# Altium project DM3370.PrjPcb (part 7 of 14)

## Sheet DM3370_PCIe.SchDoc: =project_title
size Tabloid; CompanyName: Luxonis Holding; DrawnBy: David Malovrh; Organization: Luxonis Holding; Address1: 1925 Harmony Park Drive; Address2: Westminster, CO; Address3: 80234; Address4: United States; DocumentNumber: 12; Revision: R5M2E5; SheetNumber: 12; SheetTotal: 17
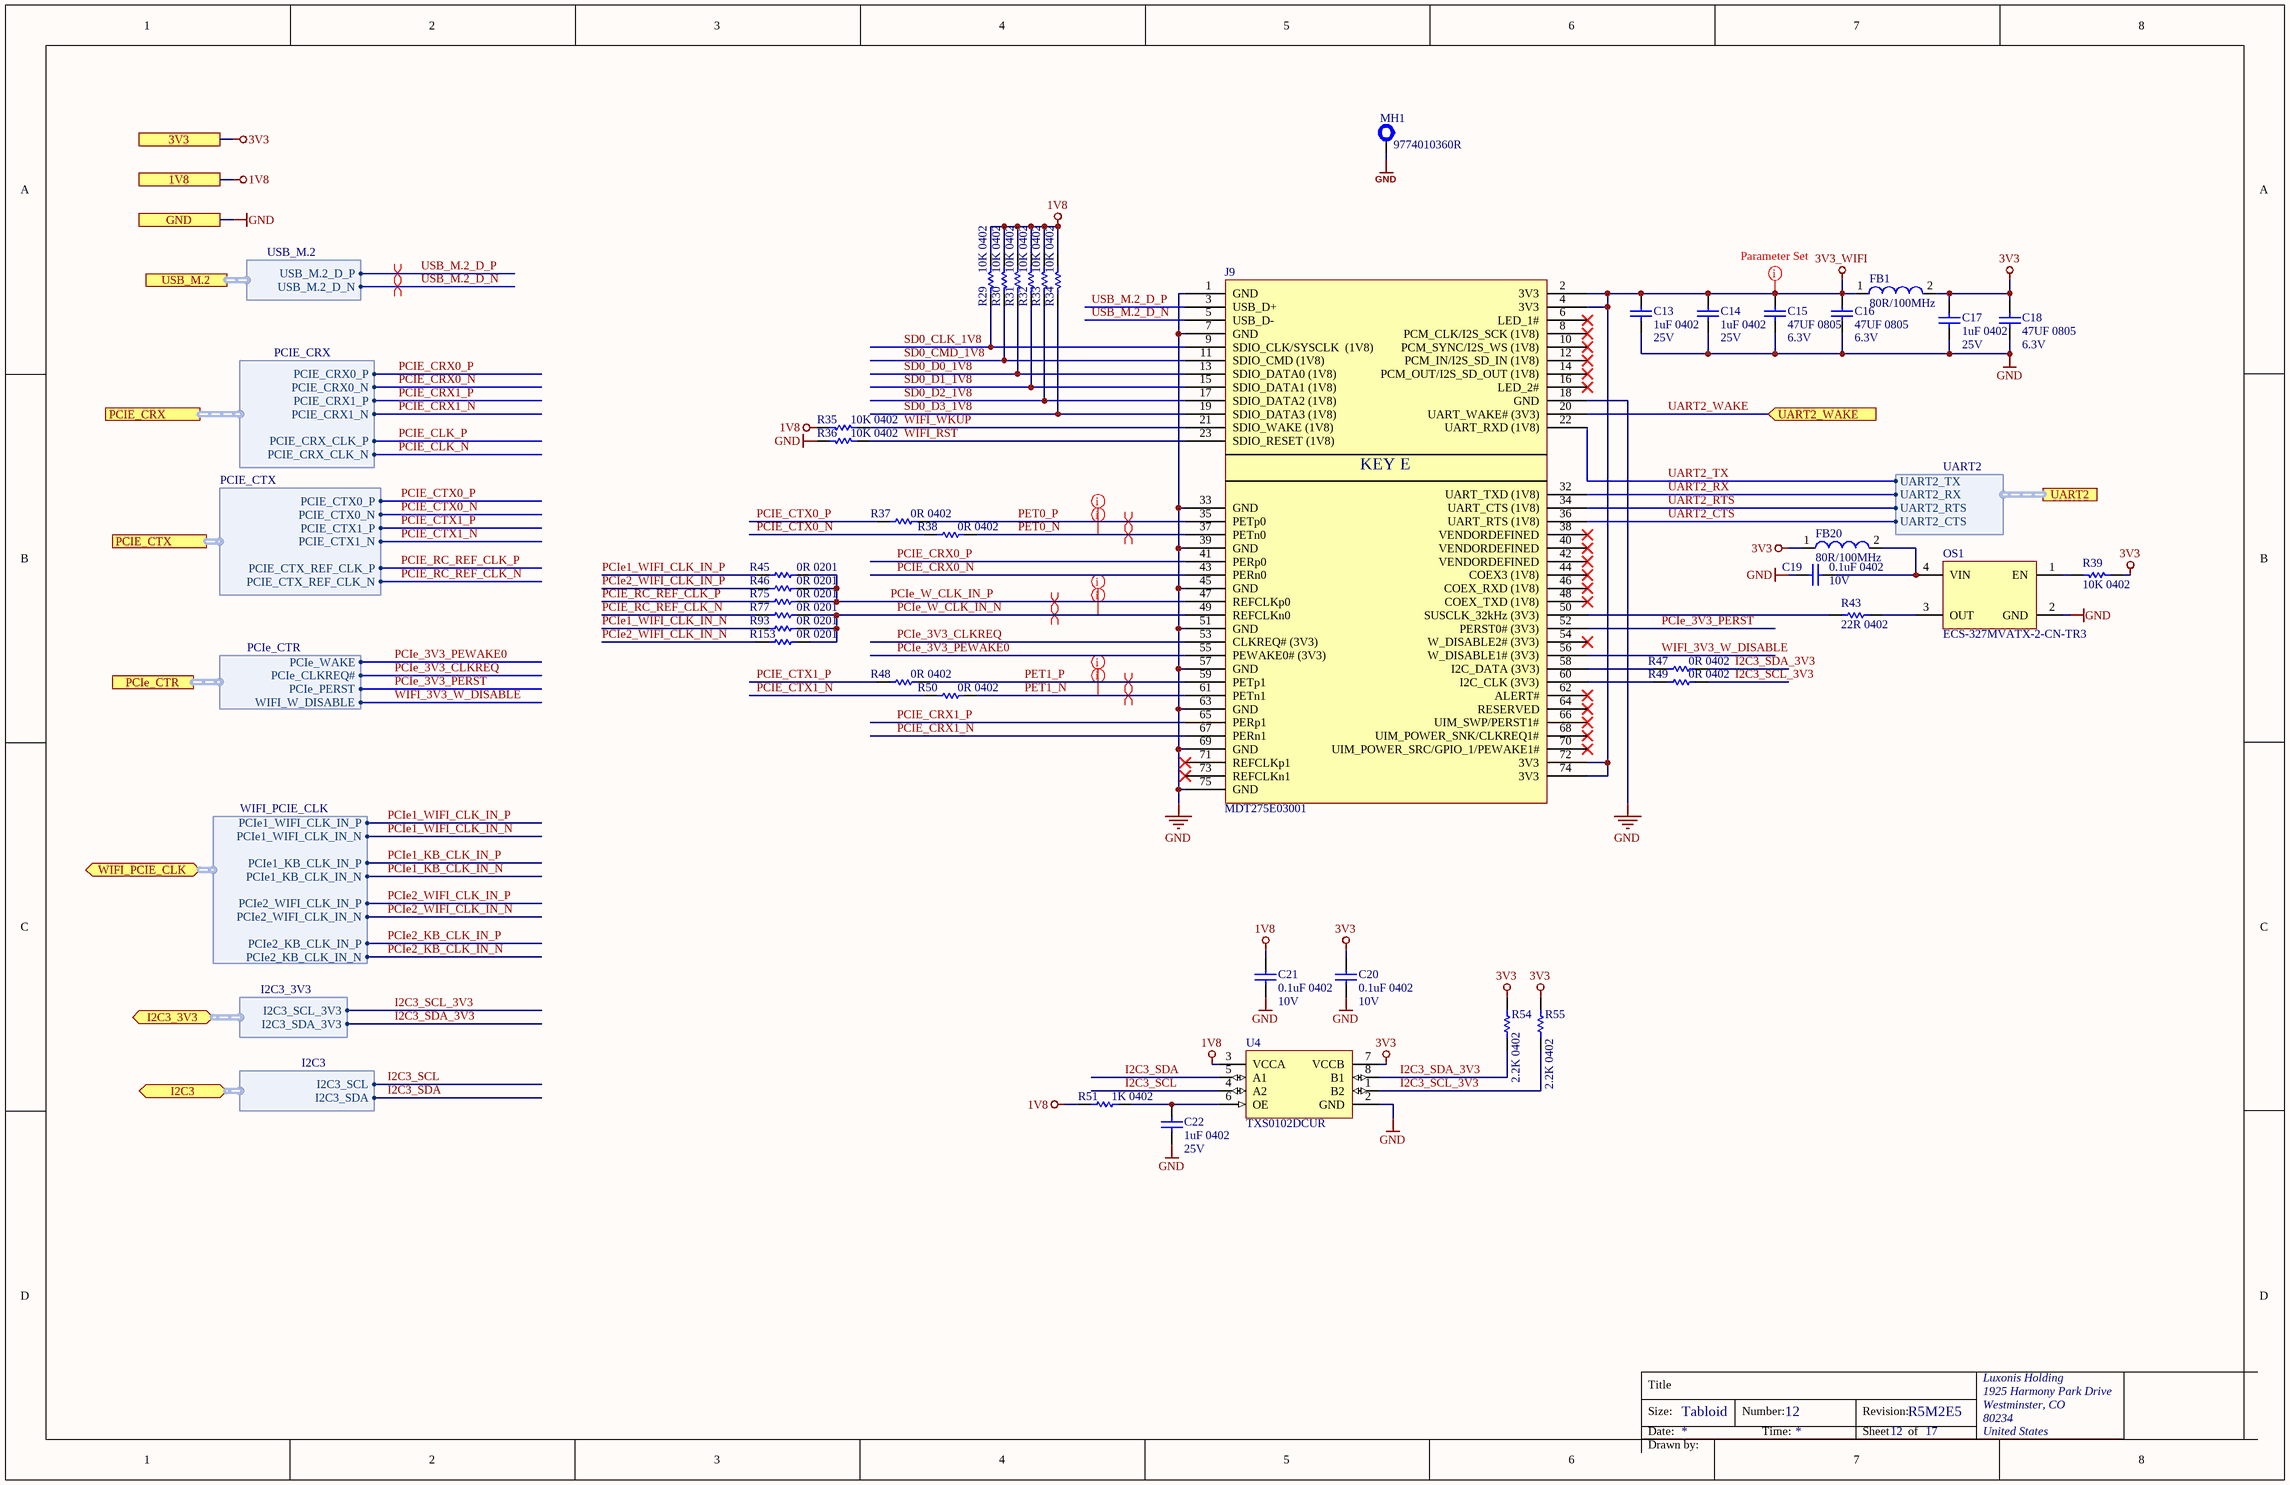
[diagram p11: DM3370_PCIe.SchDoc]

### Parts
C13  1uF 0402  Voltage Rating: 25V  [CAPC0402(1005)70_L]
C14  1uF 0402  Voltage Rating: 25V  [CAPC0402(1005)70_L]
C15  47UF 0805  Voltage: 6.3V  [CAPC0805(2012)145_L]
C16  47UF 0805  Voltage: 6.3V  [CAPC0805(2012)145_L]
C17  1uF 0402  Voltage Rating: 25V  [CAPC0402(1005)70_L]
C18  47UF 0805  Voltage: 6.3V  [CAPC0805(2012)145_L]
C19  0.1uF 0402  Voltage Rating: 10V  [CAPC0402(1005)70_L]
C20  0.1uF 0402  Voltage Rating: 10V  [CAPC0402(1005)70_L]
C21  0.1uF 0402  Voltage Rating: 10V  [CAPC0402(1005)70_L]
C22  1uF 0402  Voltage Rating: 25V  [CAPC0402(1005)70_L]
FB1  80R/100MHz  [BK1608HS800-T_L]
FB20  80R/100MHz  [BK1608HS800-T_L]
J9  MDT275E03001  [MDT275E]
MH1  9774010360R  [9774010360R]
OS1  ECS-327MVATX-2-CN-TR3  [2520_OSC(FJ2400002)]
R29  10K 0402  [RESC0402(1005)_L]
R30  10K 0402  [RESC0402(1005)_L]
R31  10K 0402  [RESC0402(1005)_L]
R32  10K 0402  [RESC0402(1005)_L]
R33  10K 0402  [RESC0402(1005)_L]
R34  10K 0402  [RESC0402(1005)_L]
R35  10K 0402  [RESC0402(1005)_L]
R36  10K 0402  [RESC0402(1005)_L]
R37  0R 0402  [RESC0402(1005)_L]
R38  0R 0402  [RESC0402(1005)_L]
R39  10K 0402  [RESC0402(1005)_L]
R43  22R 0402  [RESC0402(1005)_L]
R45  0R 0201  [RESC0201(0603)_L]
R46  0R 0201  [RESC0201(0603)_L]
R47  0R 0402  [RESC0402(1005)_L]
R48  0R 0402  [RESC0402(1005)_L]
R49  0R 0402  [RESC0402(1005)_L]
R50  0R 0402  [RESC0402(1005)_L]
R51  1K 0402  [RESC0402(1005)_L]
R54  2.2K 0402  [RESC0402(1005)_L]
R55  2.2K 0402  [RESC0402(1005)_L]
R75  0R 0201  [RESC0201(0603)_L]
R77  0R 0201  [RESC0201(0603)_L]
R93  0R 0201  [RESC0201(0603)_L]
R153  0R 0201  [RESC0201(0603)_L]
U4  TXS0102DCUR  [TXS0102DCUR]

### Ports
1V8, 3V3, GND, I2C3 (bidir, harness I2C3), I2C3_3V3 (bidir, harness I2C3_3V3), PCIE_CRX (harness PCIE_CRX), PCIe_CTR (harness PCIe_CTR), PCIE_CTX (harness PCIE_CTX), UART2 (harness UART2), UART2_WAKE (in), USB_M.2 (harness USB_M.2), WIFI_PCIE_CLK (bidir, harness WIFI_PCIE_CLK)

### Harnesses
PCIE_CRX: PCIE_CRX0_P, PCIE_CRX0_N, PCIE_CRX1_P, PCIE_CRX1_N, PCIE_CRX_CLK_P, PCIE_CRX_CLK_N
PCIE_CTX: PCIE_CTX0_P, PCIE_CTX0_N, PCIE_CTX1_P, PCIE_CTX1_N, PCIE_CTX_REF_CLK_P, PCIE_CTX_REF_CLK_N
PCIe_CTR: PCIe_CLKREQ#, PCIe_PERST, PCIe_WAKE, WIFI_W_DISABLE
UART2: UART2_TX, UART2_RX, UART2_CTS, UART2_RTS
WIFI_PCIE_CLK: PCIe1_WIFI_CLK_IN_P, PCIe1_WIFI_CLK_IN_N, PCIe1_KB_CLK_IN_P, PCIe1_KB_CLK_IN_N, PCIe2_WIFI_CLK_IN_P, PCIe2_WIFI_CLK_IN_N, PCIe2_KB_CLK_IN_P, PCIe2_KB_CLK_IN_N
I2C3_3V3: I2C3_SCL_3V3, I2C3_SDA_3V3
I2C3: I2C3_SCL, I2C3_SDA
USB_M.2: USB_M.2_D_P, USB_M.2_D_N

### Nets
1V8: C21.2 R29.1 R30.1 R31.1 R32.1 R33.1 R34.1 R35.2 R51.2 U4.3(VCCA) ; port 1V8
3V3: C17.2 C18.2 C20.2 FB1.2 FB20.1 R39.2 R54.2 R55.2 U4.7(VCCB) ; port 3V3
3V3_WIFI: C13.2 C14.2 C15.2 C16.2 FB1.1 J9.2(3V3) J9.4(3V3) J9.72(3V3) J9.74(3V3)
GND: C13.1 C14.1 C15.1 C16.1 C17.1 C18.1 C19.1 C20.1 C21.1 C22.1 J9.1(GND) J9.7(GND) J9.18(GND) J9.33(GND) J9.39(GND) J9.45(GND) J9.51(GND) J9.57(GND) J9.63(GND) J9.69(GND) J9.75(GND) MH1.1 OS1.2(GND) R36.2 U4.2(GND) ; port GND
I2C3_SCL: U4.4(A2) ; port I2C3.I2C3_SCL
I2C3_SCL_3V3: R49.2 R55.1 U4.1(B2) ; port I2C3_3V3.I2C3_SCL_3V3
I2C3_SDA: U4.5(A1) ; port I2C3.I2C3_SDA
I2C3_SDA_3V3: R47.2 R54.1 U4.8(B1) ; port I2C3_3V3.I2C3_SDA_3V3
PCIe1_WIFI_CLK_IN_N: R93.1 ; port WIFI_PCIE_CLK.PCIe1_WIFI_CLK_IN_N
PCIe1_WIFI_CLK_IN_P: R45.1 ; port WIFI_PCIE_CLK.PCIe1_WIFI_CLK_IN_P
PCIe2_WIFI_CLK_IN_N: R153.1 ; port WIFI_PCIE_CLK.PCIe2_WIFI_CLK_IN_N
PCIe2_WIFI_CLK_IN_P: R46.1 ; port WIFI_PCIE_CLK.PCIe2_WIFI_CLK_IN_P
PCIe_3V3_CLKREQ: J9.53(CLKREQ#_(3V3)) ; port PCIe_CTR.PCIe_CLKREQ#
PCIe_3V3_PERST: J9.52(PERST0#_(3V3)) ; port PCIe_CTR.PCIe_PERST
PCIe_3V3_PEWAKE0: J9.55(PEWAKE0#_(3V3)) ; port PCIe_CTR.PCIe_WAKE
PCIE_CRX0_N: J9.43(PERn0) ; port PCIE_CRX.PCIE_CRX0_N
PCIE_CRX0_P: J9.41(PERp0) ; port PCIE_CRX.PCIE_CRX0_P
PCIE_CRX1_N: J9.67(PERn1) ; port PCIE_CRX.PCIE_CRX1_N
PCIE_CRX1_P: J9.65(PERp1) ; port PCIE_CRX.PCIE_CRX1_P
PCIE_CTX0_N: R38.1 ; port PCIE_CTX.PCIE_CTX0_N
PCIE_CTX0_P: R37.1 ; port PCIE_CTX.PCIE_CTX0_P
PCIE_CTX1_N: R50.1 ; port PCIE_CTX.PCIE_CTX1_N
PCIE_CTX1_P: R48.1 ; port PCIE_CTX.PCIE_CTX1_P
PCIE_RC_REF_CLK_N: R77.1 ; port PCIE_CTX.PCIE_CTX_REF_CLK_N
PCIE_RC_REF_CLK_P: R75.1 ; port PCIE_CTX.PCIE_CTX_REF_CLK_P
PCIe_W_CLK_IN_N: J9.49(REFCLKn0) R77.2 R93.2 R153.2
PCIe_W_CLK_IN_P: J9.47(REFCLKp0) R45.2 R46.2 R75.2
PET0_N: J9.37(PETn0) R38.2
PET0_P: J9.35(PETp0) R37.2
PET1_N: J9.61(PETn1) R50.2
PET1_P: J9.59(PETp1) R48.2
SD0_CLK_1V8: J9.9(SDIO_CLK/SYSCLK__(1V8)) R29.2
SD0_CMD_1V8: J9.11(SDIO_CMD_(1V8)) R30.2
SD0_D0_1V8: J9.13(SDIO_DATA0_(1V8)) R31.2
SD0_D1_1V8: J9.15(SDIO_DATA1_(1V8)) R32.2
SD0_D2_1V8: J9.17(SDIO_DATA2_(1V8)) R33.2
SD0_D3_1V8: J9.19(SDIO_DATA3_(1V8)) R34.2
UART2_CTS: J9.36(UART_RTS_(1V8)) ; port UART2.UART2_CTS
UART2_RTS: J9.34(UART_CTS_(1V8)) ; port UART2.UART2_RTS
UART2_RX: J9.32(UART_TXD_(1V8)) ; port UART2.UART2_RX
UART2_TX: J9.22(UART_RXD_(1V8)) ; port UART2.UART2_TX
UART2_WAKE: J9.20(UART_WAKE#_(3V3)) ; port UART2_WAKE
USB_M.2_D_N: J9.5(USB_D-) ; port USB_M.2.USB_M.2_D_N
USB_M.2_D_P: J9.3(USB_D+) ; port USB_M.2.USB_M.2_D_P
WIFI_3V3_W_DISABLE: J9.56(W_DISABLE1#_(3V3)) ; port PCIe_CTR.WIFI_W_DISABLE
WIFI_RST: J9.23(SDIO_RESET_(1V8)) R36.1
WIFI_WKUP: J9.21(SDIO_WAKE_(1V8)) R35.1
NetC19_2: C19.2 FB20.2 OS1.4(VIN)
NetC22_2: C22.2 R51.1 U4.6(OE)
NetJ9_50: J9.50(SUSCLK_32kHz_(3V3)) R43.2
NetJ9_58: J9.58(I2C_DATA_(3V3)) R47.1
NetJ9_60: J9.60(I2C_CLK_(3V3)) R49.1
NetOS1_1: OS1.1(EN) R39.1
NetOS1_3: OS1.3(OUT) R43.1

Not connected (* = marked no-connect by the designer): J9 6(LED_1#)* 8(PCM_CLK/I2S_SCK_(1V8))* 10(PCM_SYNC/I2S_WS_(1V8))* 12(PCM_IN/I2S_SD_IN_(1V8))* 14(PCM_OUT/I2S_SD_OUT_(1V8))* 16(LED_2#)* 38(VENDORDEFINED)* 40(VENDORDEFINED)* 42(VENDORDEFINED)* 44(COEX3_(1V8))* 46(COEX_RXD_(1V8))* 48(COEX_TXD_(1V8))* 54(W_DISABLE2#_(3V3))* 62(ALERT#)* 64(RESERVED)* 66(UIM_SWP/PERST1#)* 68(UIM_POWER_SNK/CLKREQ1#)* 70(UIM_POWER_SRC/GPIO_1/PEWAKE1#)* 71(REFCLKp1)* 73(REFCLKn1)*

### Layout directives
differential pair; differential pair class 100ohm; net class PCIE: PCIe_W_CLK_IN_N, PCIe_W_CLK_IN_P, PET0_N, PET0_P, PET1_N, PET1_P
net class POWER: 3V3_WIFI
net class PCIE: PCIe_W_CLK_IN_N, PCIe_W_CLK_IN_P, PET0_N, PET0_P, PET1_N, PET1_P
differential pair; differential pair class 90ohm: USB_M.2_D_N, USB_M.2_D_P

### Notes on the sheet
- Title
- Size:
- Date:
- Tabloid
- Number:
- Time:
- Revision:
- Sheet
- of
- Drawn by:
- (in symbol CMP-002-00122-1) KEY E

### Library data of the parts
C13 C14 C17 C22 = GRM155R61E105KA12D: as C160 on sheet DM3370_LCD_LEDring; Supplier 1: Digi-Key; Manufacturer Part Number 1: GRM155R61E105KA12D; Stock 1: 200653; Pricing 1: 1=0.10000, 10=0.07100, 100=0.03350, 500=0.02352, 1000=0.01947, 2500=0.01812, 5000=0.01658 (USD); RoHS: Yes; Mount: Surface Mount; Case/Package: 0402; Weight: 0.000212oz; Case Code (Metric): 1005; Case Code (Imperial): 0402; Min Operating Temperature: -55°C; Max Operating Temperature: 85°C; Tolerance: 10%; Capacitance: 1uF; Dielectric: X5R; Voltage Rating (DC): 25V; Packaging: Tape and Reel; Package Quantity: 10000; Termination: SMD/SMT; Voltage: 25V; Length: 1mm; Height: 0.5mm; Width: 0.5mm; Thickness: 0.022inch; Depth: 0.5mm; Lead Free: Lead Free; REACH SVHC: No SVHC; ComponentLink1URL: https://datasheet.ciiva.com/22732/1666664-22732122.pdf?src-supplier=Element14; ComponentLink1Description: https://datasheet.ciiva.com/22732/1666664-22732122.pdf?src-supplier=Element14; ComponentLink2URL: https://datasheet.ciiva.com/7719/1666664-7719006.pdf?src-supplier=Element14; ComponentLink2Description: https://datasheet.ciiva.com/7719/1666664-7719006.pdf?src-supplier=Element14; Supplier Part Number 1: 490-10017-1-ND; Supplier 2: Arrow; Supplier 3: TTI; Supplier Part Number 2: GRM155R61E105KA12D; Supplier Part Number 3: GRM155R61E105KA12D
C15 C16 C18 = GRM21BR60J476ME15L: CAP CER 47UF 6.3V X5R 0805; Manufacturer 1: Murata; Tolerance: 20%; Supplier 1: Digi-Key; Manufacturer Part Number 1: GRM21BR60J476ME15L; Stock 1: 16165; Pricing 1: 1=0.48000, 10=0.33900, 100=0.22360, 500=0.16560, 1000=0.14076 (USD); RoHS: Yes; Mount: Surface Mount; Case/Package: 0805; Weight: 0.000335oz; Case Code (Metric): 2012; Case Code (Imperial): 0805; Min Operating Temperature: -55°C; Max Operating Temperature: 85°C; Voltage Rating: 6.3V; Packaging: Tape and Reel; Capacitance: 47uF; Voltage Rating (DC): 6.3V; Package Quantity: 3000; Termination: SMD/SMT; Dielectric: X5R; Length: 2mm; Height: 1.25mm; Width: 0.049inch; Depth: 1.25mm; Thickness: 0.057inch; Lead Free: Lead Free; REACH SVHC: No SVHC; ComponentLink1URL: https://datasheet.ciiva.com/46444/1754700-46444997.pdf?src-supplier=Element14; ComponentLink1Description: https://datasheet.ciiva.com/46444/1754700-46444997.pdf?src-supplier=Element14; Supplier 2: Newark; Supplier 3: Mouser; Supplier Part Number 1: 490-9960-1-ND; Supplier Part Number 2: 40X5890; Supplier Part Number 3: 81-GRM21BR60J476ME5L
C19-C21 = GRM155R71A104JA01D: as C158 on sheet DM3370_LCD_LEDring; Supplier 1: Digi-Key; Manufacturer Part Number 1: GRM155R71A104JA01D; Stock 1: 1346709; Pricing 1: 1=0.10000, 10=0.02500, 100=0.01130, 500=0.00806, 1000=0.00633, 2500=0.00575, 5000=0.00529 (USD); RoHS: Yes; Mount: Surface Mount; Case/Package: 0402; Case Code (Imperial): 0402; Case Code (Metric): 1005; Min Operating Temperature: -55°C; Max Operating Temperature: 125°C; Tolerance: 5%; Packaging: Tape and Reel; Voltage Rating (DC): 10V; Dielectric: X7R; Package Quantity: 10000; Termination: SMD/SMT; Length: 1mm; Height: 0.5mm; Width: 0.02inch; Thickness: 0.022inch; Depth: 0.5mm; Radiation Hardening: No; Lead Free: Lead Free; ComponentLink1URL: https://datasheet.ciiva.com/5411/product-5411135.pdf?src-supplier=Mouser; ComponentLink1Description: https://datasheet.ciiva.com/5411/product-5411135.pdf?src-supplier=Mouser; ComponentLink2URL: https://datasheet.ciiva.com/11618/c02e-11618821.pdf?src-supplier=Avnet; ComponentLink2Description: https://datasheet.ciiva.com/11618/c02e-11618821.pdf?src-supplier=Avnet; Supplier Part Number 1: 490-10777-1-ND
FB1 FB20 = BK1608HS800-T: FERRITE BEAD 80 OHM 0603 1LN; Manufacturer 1: Taiyo Yuden; Impedance: 80R; Tolerance: 25%; Max DC Current: 600mA; DC Resistance (DCR): 100mR; Test Frequency: 100MHz; Number of Lines: 1; Shielding: Shielded; Supplier 1: Digi-Key; Manufacturer Part Number 1: BK1608HS800-T; Stock 1: 6285; Pricing 1: 1=0.10000, 10=0.07900, 25=0.07200, 50=0.06480, 100=0.04760, 250=0.03460, 500=0.03170, 1000=0.02738 (USD); RoHS: Yes; Mount: Surface Mount; Case/Package: 0603; Number of Pins: 2; Core Material: Ferrite; Case Code (Metric): 1608; Case Code (Imperial): 0603; Min Operating Temperature: -55°C; Max Operating Temperature: 125°C; Package Quantity: 1; Packaging: Tape and Reel; Termination: SMD/SMT; Max Current Rating: 600mA; Frequency: 100MHz; Length: 0.063inch; Height: 0.037inch; Width: 0.8mm; Depth: 0.95mm; REACH SVHC: Unknown; Lead Free: Lead Free; Halogen Free: Halogen Free; ComponentLink1URL: https://datasheet.ciiva.com/1011/bk1608hs800-t-ss-1011885.pdf?src-supplier=Digi-Key; ComponentLink1Description: https://datasheet.ciiva.com/1011/bk1608hs800-t-ss-1011885.pdf?src-supplier=Digi-Key; ComponentLink2URL: https://datasheet.ciiva.com/1011/mlci07-e-1011886.pdf?src-supplier=Digi-Key; ComponentLink2Description: https://datasheet.ciiva.com/1011/mlci07-e-1011886.pdf?src-supplier=Digi-Key; ComponentLink3URL: https://datasheet.ciiva.com/1011/mlci07-e-1011887.pdf?src-supplier=Digi-Key; ComponentLink3Description: https://datasheet.ciiva.com/1011/mlci07-e-1011887.pdf?src-supplier=Digi-Key; Supplier 2: Mouser; Supplier 3: Arrow; Supplier Part Number 1: 587-1875-1-ND; Supplier Part Number 2: 963-BK1608HS800-T; Supplier Part Number 3: BK1608HS800-T
J9 = CMP-002-00122-1: Conn Card Edge RCP 67 POS 0.5mm Solder RA SMD; Manufacturer 1: Amphenol Commercial; Stock 1: 1980; Manufacturer Part Number 1: MDT275E03001; Design Item ID: MDT420E03001; Category: Card Edge Connectors; RoHS: Yes
MH1 = CMP-00015-1: Spacers/Standoffs; Manufacturer 1: Wuerth; Manufacturer Part Number 1: 9774010360R
OS1 = CMP-016-000027-1: SMD Crystal Oscillator 32.768KHz 1.6V to 3.6V 15pF 4-Pin Miniature CSMD T/R; Manufacturer 1: ECS International; Pricing 1: 1=1,12000, 10=0,98900, 50=0,92440, 100=0,81700, 500=0,77400, 1000=0,64500 (USD); RoHS: No; Design Item ID: ECS-327MVATX-2-CN-TR3; Manufacturer Part Number 1: ECS-327MVATX-2-CN-TR3; Source: LuxonisMaster.SchLib; Stock 1: 3071
R29-R36 R39 = RC0402FR-1310KL: as R118 on sheet DM3370_LCD_LEDring; ComponentLink1URL: https://datasheet.ciiva.com/16940/pyu-rc0402-51-rohs-l-6-16940293.pdf?src-supplier=Avnet+Europe; ComponentLink1Description: https://datasheet.ciiva.com/16940/pyu-rc0402-51-rohs-l-6-16940293.pdf?src-supplier=Avnet+Europe; ComponentLink2URL: https://datasheet.ciiva.com/28386/pyu-rc0402-51-rohs-l-6-28386855.pdf?src-supplier=Avnet+Europe; ComponentLink2Description: https://datasheet.ciiva.com/28386/pyu-rc0402-51-rohs-l-6-28386855.pdf?src-supplier=Avnet+Europe; ComponentLink3URL: https://datasheet.ciiva.com/16740/pyu-rc0402-51-rohs-l-6-r-16740602.pdf?src-supplier=Future+Electronics; ComponentLink3Description: https://datasheet.ciiva.com/16740/pyu-rc0402-51-rohs-l-6-r-16740602.pdf?src-supplier=Future+Electronics; ComponentLink4URL: https://datasheet.ciiva.com/8891/pyu-rc0402-51-rohs-l-6-8891339.pdf?src-supplier=Avnet; ComponentLink4Description: https://datasheet.ciiva.com/8891/pyu-rc0402-51-rohs-l-6-8891339.pdf?src-supplier=Avnet; ComponentLink5URL: https://datasheet.ciiva.com/5557/pyu-rc0402-51-rohs-l-6-r-5557997.pdf?src-supplier=Mouser; ComponentLink5Description: https://datasheet.ciiva.com/5557/pyu-rc0402-51-rohs-l-6-r-5557997.pdf?src-supplier=Mouser; ComponentLink6URL: https://datasheet.ciiva.com/7983/1018594-7983533.pdf?src-supplier=Element14; ComponentLink6Description: https://datasheet.ciiva.com/7983/1018594-7983533.pdf?src-supplier=Element14; Supplier 1: Newark; Manufacturer Part Number 1: RC0402FR-1310KL; Stock 1: 62239; Pricing 1: 1=0.10000, 25=0.01200, 100=0.00400, 250=0.00400, 500=0.00300, 1000=0.00300 (USD); RoHS: Yes; Case/Package: 0402; Number of Pins: 2; Contact Plating: Tin,Matte,Lead; Case Code (Imperial): 0402; Case Code (Metric): 1005; Min Operating Temperature: -55°C; Max Operating Temperature: 155°C; Tolerance: 1%; Composition: Thick Film; Packaging: Tape and Reel; Termination: SMD/SMT; Military Standard: Not; Voltage Rating (DC): 50V; Working Voltage: 50V; Number of Terminations: 2; Length: 1mm; Depth: 0.5mm; Radiation Hardening: No; REACH SVHC: No SVHC; Lead Free: Lead Free; Supplier Part Number 1: 67R9960
  R29-R36: Supplier 2: Future Electronics; Supplier 3: Mouser; Supplier 4: Element14; Supplier Part Number 2: RC0402FR-1310KL-CUTT; Supplier Part Number 3: 603-RC0402FR-1310KL; Supplier Part Number 4: 1799235
R37 R38 R47-R50 = CRCW04020000Z0ED: as R158 on sheet DM3370_LCD_LEDring; Supplier 1: Digi-Key; Manufacturer Part Number 1: CRCW04020000Z0ED; Stock 1: 855968; Pricing 1: 1=0.10000, 10=0.03400, 25=0.02440, 50=0.01860, 100=0.01380, 250=0.01048, 500=0.00840, 1000=0.00618, 5000=0.00443 (USD); RoHS: Yes; Mount: Surface Mount; Case/Package: 0402; Weight: 2.3E-05oz; Case Code (Imperial): 0402; Case Code (Metric): 1005; Contact Plating: Tin; Min Operating Temperature: -55°C; Max Operating Temperature: 155°C; Packaging: Tape and Reel; Composition: Thick Film; Voltage Rating (DC): 50V; Package Quantity: 1; Termination: SMD/SMT; Number of Terminations: 2; Military Standard: Not; Max Power Dissipation: 63mW; Features: Automotive AEC-Q200; Length: 1mm; Height: 0.35mm; Width: 0.5mm; Depth: 0.5mm; Radiation Hardening: No; REACH SVHC: Unknown; Lead Free: Lead Free; ComponentLink1URL: https://datasheet.ciiva.com/3255/dcrcwe3-3255944.pdf?src-supplier=Avnet; ComponentLink1Description: https://datasheet.ciiva.com/3255/dcrcwe3-3255944.pdf?src-supplier=Avnet; ComponentLink2URL: https://datasheet.ciiva.com/3255/dcrcwe3-3255945.pdf?src-supplier=Avnet; ComponentLink2Description: https://datasheet.ciiva.com/3255/dcrcwe3-3255945.pdf?src-supplier=Avnet; ComponentLink3URL: https://datasheet.ciiva.com/16881/dcrcwe3-16881413.pdf?src-supplier=Avnet+Europe; ComponentLink3Description: https://datasheet.ciiva.com/16881/dcrcwe3-16881413.pdf?src-supplier=Avnet+Europe; ComponentLink4URL: https://datasheet.ciiva.com/2461/dcrcwe3-2461962.pdf?src-supplier=Digi-Key; ComponentLink4Description: https://datasheet.ciiva.com/2461/dcrcwe3-2461962.pdf?src-supplier=Digi-Key; ComponentLink5URL: https://datasheet.ciiva.com/7841/1720486-7841802.pdf?src-supplier=Element14; ComponentLink5Description: https://datasheet.ciiva.com/7841/1720486-7841802.pdf?src-supplier=Element14; ComponentLink6URL: https://datasheet.ciiva.com/2461/dcrcwe3-2461963.pdf?src-supplier=Digi-Key; ComponentLink6Description: https://datasheet.ciiva.com/2461/dcrcwe3-2461963.pdf?src-supplier=Digi-Key; ComponentLink7URL: https://datasheet.ciiva.com/2461/dcrcwe3-2461964.pdf?src-supplier=Digi-Key; ComponentLink7Description: https://datasheet.ciiva.com/2461/dcrcwe3-2461964.pdf?src-supplier=Digi-Key; ComponentLink8URL: https://datasheet.ciiva.com/7841/1697337-7841468.pdf?src-supplier=Element14; ComponentLink8Description: https://datasheet.ciiva.com/7841/1697337-7841468.pdf?src-supplier=Element14; ComponentLink9URL: https://datasheet.ciiva.com/16761/70200976-16761309.pdf?src-supplier=Allied+Electronics; ComponentLink9Description: https://datasheet.ciiva.com/16761/70200976-16761309.pdf?src-supplier=Allied+Electronics; ComponentLink10URL: https://datasheet.ciiva.com/26311/fld-crcw-e3-data-en-26311550.pdf?src-supplier=Distrelec; ComponentLink10Description: https://datasheet.ciiva.com/26311/fld-crcw-e3-data-en-26311550.pdf?src-supplier=Distrelec; Supplier Part Number 1: 541-0.0JCT-ND
R43 = RC0402FR-0722RL: RES SMD 22 OHM 1% 1/16W 0402; Manufacturer 1: Yageo; Temperature Coefficient: 100ppm/°C; Power Rating: 63mW; Voltage Rating: 50V; Supplier 1: Digi-Key; Manufacturer Part Number 1: RC0402FR-0722RL; Stock 1: 24616988; Pricing 1: 1=0.10000, 10=0.01600, 100=0.00640, 1000=0.00289, 2500=0.00251, 5000=0.00207 (USD); RoHS: Yes; Case/Package: 0402; Number of Pins: 2; Case Code (Metric): 1005; Case Code (Imperial): 0402; Min Operating Temperature: -55°C; Max Operating Temperature: 155°C; Tolerance: 1%; Resistance: 22R; Packaging: Tape and Reel; Composition: Thick Film; Voltage Rating (DC): 50V; Termination: SMD/SMT; Military Standard: Not; Length: 1mm; Height: 0.32mm; Width: 0.5mm; Depth: 0.5mm; REACH SVHC: Unknown; Lead Free: Lead Free; ComponentLink1URL: https://datasheet.ciiva.com/11819/0900766b80c66297-11819462.pdf?src-supplier=RSComponents; ComponentLink1Description: https://datasheet.ciiva.com/11819/0900766b80c66297-11819462.pdf?src-supplier=RSComponents; ComponentLink2URL: https://datasheet.ciiva.com/7849/1018594-7849911.pdf?src-supplier=Element14; ComponentLink2Description: https://datasheet.ciiva.com/7849/1018594-7849911.pdf?src-supplier=Element14; ComponentLink3URL: https://datasheet.ciiva.com/26829/getdatasheetpartid-554995-26829991.pdf?src-supplier=Verical; ComponentLink3Description: https://datasheet.ciiva.com/26829/getdatasheetpartid-554995-26829991.pdf?src-supplier=Verical; ComponentLink4URL: https://datasheet.ciiva.com/7849/1018594-7849912.pdf?src-supplier=Element14; ComponentLink4Description: https://datasheet.ciiva.com/7849/1018594-7849912.pdf?src-supplier=Element14; ComponentLink5URL: https://datasheet.ciiva.com/16930/pyu-rc0402-51-rohs-l-6-r-16930687.pdf?src-supplier=Future+Electronics; ComponentLink5Description: https://datasheet.ciiva.com/16930/pyu-rc0402-51-rohs-l-6-r-16930687.pdf?src-supplier=Future+Electronics; Supplier 2: Newark; Supplier 3: Mouser; Supplier Part Number 2: 26M6784; Supplier Part Number 3: 603-RC0402FR-0722RL; Supplier Part Number 1: 311-22.0LRCT-ND; Category: Chip SMD Resistors
R45 R46 R75 R77 R93 R153 = CRCW02010000Z0ED: RES SMD 0 OHM JUMPER 1/16W 0201; Manufacturer 1: Vishay; Rated Power Dissipation (P): 50mW; Rated Temperature: 70°C; Package Height: 0.23mm; Package Length: 0.6mm; Package Width: 0.3mm; Reference Standard: AEC-Q200; Supplier 1: Newark; Manufacturer Part Number 1: CRCW02010000Z0ED; RoHS: Yes; Category: Chip SMD Resistors; Stock 1: 200000; Pricing 1: 1=0,03600, 10000=0,03600, 30000=0,03400 (USD); Mount: Surface Mount; Number of Pins: 2; Package Shape: Rectangular; Size Code: 0201; Terminal Finish: Nickel; Min Operating Temperature: -55°C; Max Operating Temperature: 155°C; JESD-609 Code: e3; Resistor Type: FIXED RESISTOR; Construction: Chip; Package Style: SMTMeter; Packaging: Tape and Reel; Resistance: 0R; Technology: METAL GLAZE/THICK FILM; Termination: Wraparound; REACH SVHC: Yes; RoHS Compliant: Yes; ComponentLink1URL: https://datasheet.ciiva.com:443/pdfs/VipMasterIC/IC/VISH/VISH-S-A0002932828/VISH-S-A0002932828-1.pdf?src-supplier=IHS+Markit; ComponentLink1Description: https://datasheet.ciiva.com:443/pdfs/VipMasterIC/IC/VISH/VISH-S-A0002932828/VISH-S-A0002932828-1.pdf?src-supplier=IHS+Markit; ComponentLink2URL: https://datasheet.ciiva.com/2471/crcw0201e3-2471712.pdf?src-supplier=Digi-Key; ComponentLink2Description: https://datasheet.ciiva.com/2471/crcw0201e3-2471712.pdf?src-supplier=Digi-Key; ComponentLink3URL: https://datasheet.ciiva.com/2471/crcw0201e3-2471713.pdf?src-supplier=Digi-Key; ComponentLink3Description: https://datasheet.ciiva.com/2471/crcw0201e3-2471713.pdf?src-supplier=Digi-Key; ComponentLink4URL: https://datasheet.ciiva.com/7841/1719906-7841431.pdf?src-supplier=Element14; ComponentLink4Description: https://datasheet.ciiva.com/7841/1719906-7841431.pdf?src-supplier=Element14; ComponentLink5URL: https://datasheet.ciiva.com/22665/1847332-22665688.pdf?src-supplier=Element14; ComponentLink5Description: https://datasheet.ciiva.com/22665/1847332-22665688.pdf?src-supplier=Element14; ComponentLink6URL: https://datasheet.ciiva.com/2471/crcw0201e3-2471711.pdf?src-supplier=Digi-Key; ComponentLink6Description: https://datasheet.ciiva.com/2471/crcw0201e3-2471711.pdf?src-supplier=Digi-Key; ComponentLink7URL: https://datasheet.ciiva.com/7841/1719906-7841430.pdf?src-supplier=Element14; ComponentLink7Description: https://datasheet.ciiva.com/7841/1719906-7841430.pdf?src-supplier=Element14; ComponentLink8URL: https://datasheet.ciiva.com/16757/70202042-16757849.pdf?src-supplier=Allied+Electronics; ComponentLink8Description: https://datasheet.ciiva.com/16757/70202042-16757849.pdf?src-supplier=Allied+Electronics; ComponentLink9URL: https://datasheet.ciiva.com/16436/crcw0201e3-16436237.pdf?src-supplier=Future+Electronics; ComponentLink9Description: https://datasheet.ciiva.com/16436/crcw0201e3-16436237.pdf?src-supplier=Future+Electronics; Supplier Part Number 1: 24W1433
R51 = RC0402FR-071KL: as R176 on sheet DM3370_LCD_LEDring; RoHS: Yes; Number of Pins: 2; Case Code (Imperial): 0402; Case Code (Metric): 1005; Min Operating Temperature: -55°C; Max Operating Temperature: 155°C; Packaging: Tape and Reel; Composition: Thick Film; Voltage Rating: 50V; Military Standard: Not; Termination: SMD/SMT; Length: 1mm; Height: 0.32mm; Width: 0.5mm; Depth: 0.5mm; Lead Free: Lead Free; REACH SVHC: Unknown; ComponentLink1URL: https://datasheet.ciiva.com/11819/0900766b80c66297-11819477.pdf?src-supplier=RSComponents; ComponentLink1Description: https://datasheet.ciiva.com/11819/0900766b80c66297-11819477.pdf?src-supplier=RSComponents; ComponentLink2URL: https://datasheet.ciiva.com/12666/pyu-rc0402-51-rohs-l-6-r-12666741.pdf?src-supplier=Mouser; ComponentLink2Description: https://datasheet.ciiva.com/12666/pyu-rc0402-51-rohs-l-6-r-12666741.pdf?src-supplier=Mouser; ComponentLink3URL: https://datasheet.ciiva.com/17063/pyu-rc0402-51-rohs-l-6-r-17063193.pdf?src-supplier=Future+Electronics; ComponentLink3Description: https://datasheet.ciiva.com/17063/pyu-rc0402-51-rohs-l-6-r-17063193.pdf?src-supplier=Future+Electronics; ComponentLink4URL: https://datasheet.ciiva.com/22747/1018594-22747513.pdf?src-supplier=Element14; ComponentLink4Description: https://datasheet.ciiva.com/22747/1018594-22747513.pdf?src-supplier=Element14; ComponentLink5URL: https://datasheet.ciiva.com/7849/1018594-7849869.pdf?src-supplier=Element14; ComponentLink5Description: https://datasheet.ciiva.com/7849/1018594-7849869.pdf?src-supplier=Element14; ComponentLink6URL: https://datasheet.ciiva.com/7983/1018594-7983502.pdf?src-supplier=Element14; ComponentLink6Description: https://datasheet.ciiva.com/7983/1018594-7983502.pdf?src-supplier=Element14; ComponentLink7URL: https://datasheet.ciiva.com/7849/1018594-7849871.pdf?src-supplier=Element14; ComponentLink7Description: https://datasheet.ciiva.com/7849/1018594-7849871.pdf?src-supplier=Element14; Supplier 1: Digi-Key; Manufacturer Part Number 1: RC0402FR-071KL; Stock 1: 60695854; Pricing 1: 1=0.10000, 10=0.01600, 100=0.00670, 1000=0.00301, 2500=0.00261, 5000=0.00215 (USD); Case/Package: 0402; Tolerance: 1%; Supplier Part Number 1: 311-1.00KLRCT-ND
R54 R55 = RC0402FR-072K2L: RES SMD 2.2K OHM 1% 1/16W 0402; Manufacturer 1: Yageo; Resistance: 2.2kR; Temperature Coefficient: 100ppm/°C; Power Rating: 63mW; Voltage Rating: 50V; Supplier 1: Digi-Key; Manufacturer Part Number 1: RC0402FR-072K2L; Stock 1: 12579098; Pricing 1: 1=0.10000, 10=0.01600, 100=0.00640, 1000=0.00289, 2500=0.00251, 5000=0.00207 (USD); RoHS: Yes; Case/Package: 0402; Weight: 2.3E-05oz; Case Code (Imperial): 0402; Case Code (Metric): 1005; Min Operating Temperature: -55°C; Max Operating Temperature: 155°C; Packaging: Tape and Reel; Tolerance: 1%; Composition: Thick Film; Termination: SMD/SMT; Military Standard: Not; Length: 1mm; Height: 0.35mm; Width: 0.5mm; Depth: 0.5mm; Lead Free: Lead Free; REACH SVHC: Unknown; ComponentLink1URL: https://datasheet.ciiva.com/11808/0900766b80c66297-11808786.pdf?src-supplier=RSComponents; ComponentLink1Description: https://datasheet.ciiva.com/11808/0900766b80c66297-11808786.pdf?src-supplier=RSComponents; ComponentLink2URL: https://datasheet.ciiva.com/12577/pyu-rc0402-51-rohs-l-6-r-12577429.pdf?src-supplier=Mouser; ComponentLink2Description: https://datasheet.ciiva.com/12577/pyu-rc0402-51-rohs-l-6-r-12577429.pdf?src-supplier=Mouser; ComponentLink3URL: https://datasheet.ciiva.com/16741/pyu-rc0402-51-rohs-l-6-r-16741015.pdf?src-supplier=Future+Electronics; ComponentLink3Description: https://datasheet.ciiva.com/16741/pyu-rc0402-51-rohs-l-6-r-16741015.pdf?src-supplier=Future+Electronics; ComponentLink4URL: https://datasheet.ciiva.com/7983/1018594-7983515.pdf?src-supplier=Element14; ComponentLink4Description: https://datasheet.ciiva.com/7983/1018594-7983515.pdf?src-supplier=Element14; ComponentLink5URL: https://datasheet.ciiva.com/46383/1018594-46383563.pdf?src-supplier=Element14; ComponentLink5Description: https://datasheet.ciiva.com/46383/1018594-46383563.pdf?src-supplier=Element14; ComponentLink6URL: https://datasheet.ciiva.com/7849/1018594-7849928.pdf?src-supplier=Element14; ComponentLink6Description: https://datasheet.ciiva.com/7849/1018594-7849928.pdf?src-supplier=Element14; ComponentLink7URL: https://datasheet.ciiva.com/7849/1018594-7849929.pdf?src-supplier=Element14; ComponentLink7Description: https://datasheet.ciiva.com/7849/1018594-7849929.pdf?src-supplier=Element14; Supplier 2: Mouser; Supplier 3: Newark; Supplier Part Number 1: 311-2.20KLRCT-ND; Supplier Part Number 2: 603-RC0402FR-072K2L; Supplier Part Number 3: 98K7523
U4 = CMP-113-000005-1: as U23 on sheet DM3370_LCD_LEDring; Packaging: Tape and Reel; ComponentLink9URL: https://datasheet.ciiva.com/14287/txs0102-14287518.pdf?src-supplier=Avnet; Min Operating Temperature: -40°C; Max Operating Temperature: 85°C; Radiation Hardening: No; Category: Logic Gates; Lead Free: Lead Free; ComponentLink5Description: https://datasheet.ciiva.com/1899/txs0102-1899369.pdf?src-supplier=Digi-Key; ComponentLink4Description: https://datasheet.ciiva.com/1899/txs0102-1899368.pdf?src-supplier=Digi-Key; Design Item ID: TXS0102DCUR; ComponentLink8URL: https://datasheet.ciiva.com/28499/1863639-28499676.pdf?src-supplier=Element14; Number of Pins: 8; Package Quantity: 1; Pricing 1: 1=0.75000, 10=0.65900, 25=0.61960, 100=0.50550, 250=0.46956, 500=0.39964, 1000=0.31971 (USD); Source: BW2098POE_1.SCHLIB; ComponentLink2Description: https://datasheet.ciiva.com/22653/1846850-22653373.pdf?src-supplier=Farnell; ComponentLink10URL: https://datasheet.ciiva.com/46395/1863639-46395871.pdf?src-supplier=Element14; ComponentLink10Description: https://datasheet.ciiva.com/46395/1863639-46395871.pdf?src-supplier=Element14; ComponentLink2URL: https://datasheet.ciiva.com/22653/1846850-22653373.pdf?src-supplier=Farnell; ComponentLink4URL: https://datasheet.ciiva.com/1899/txs0102-1899368.pdf?src-supplier=Digi-Key; ComponentLink1URL: https://datasheet.ciiva.com/15096/getdatasheetpartid-118249-15096172.pdf?src-supplier=Verical; ComponentLink6URL: https://datasheet.ciiva.com/1899/txs0102-1899370.pdf?src-supplier=Digi-Key; Weight: 0.000339oz; Number of Channels: 2; ComponentLink5URL: https://datasheet.ciiva.com/1899/txs0102-1899369.pdf?src-supplier=Digi-Key; Quiescent Current: 14.4uA; ComponentLink3URL: https://datasheet.ciiva.com/1508/1857232-1508821.pdf?src-supplier=Element14; Manufacturer 1: Texas Instruments; ComponentLink7URL: https://datasheet.ciiva.com/14287/txs0102-14287516.pdf?src-supplier=Avnet; ComponentLink7Description: https://datasheet.ciiva.com/14287/txs0102-14287516.pdf?src-supplier=Avnet; Manufacturer Part Number 1: TXS0102DCUR; ComponentLink3Description: https://datasheet.ciiva.com/1508/1857232-1508821.pdf?src-supplier=Element14; Logic Function: Translator; ComponentLink9Description: https://datasheet.ciiva.com/14287/txs0102-14287518.pdf?src-supplier=Avnet; Case/Package: VSSOP; RoHS: Yes; ComponentLink8Description: https://datasheet.ciiva.com/28499/1863639-28499676.pdf?src-supplier=Element14; ComponentLink1Description: https://datasheet.ciiva.com/15096/getdatasheetpartid-118249-15096172.pdf?src-supplier=Verical; ComponentLink6Description: https://datasheet.ciiva.com/1899/txs0102-1899370.pdf?src-supplier=Digi-Key; Stock 1: 55123; Number of Bits: 2; REACH SVHC: No SVHC

## Sheet DM3370_IMX214.SchDoc: =project_title
size Tabloid; PageSetup: Record=PageOptions|CenterHorizontal=True|CenterVertical=True|PrintScale=0.71|XCorrection=1.00|YCorrection=1.00|PrintKind=0|BorderSize=5000000|LeftOffset=0|BottomOffset=0|Orientation=2|PaperLength=1000|PaperWidth=1000|Scale=100|PaperSource=7|PrintQuality=-4|MediaType=1|DitherType=10|PrintScaleMode=1|PaperKind=A4; CompanyName: Luxonis Holding; DrawnBy: David Malovrh; Organization: Luxonis Holding; Address1: 1925 Harmony Park Drive; Address2: Westminster, CO; Address3: 80234; Address4: United States; DocumentNumber: 8; Revision: R5M2E5; SheetNumber: 8; SheetTotal: 17
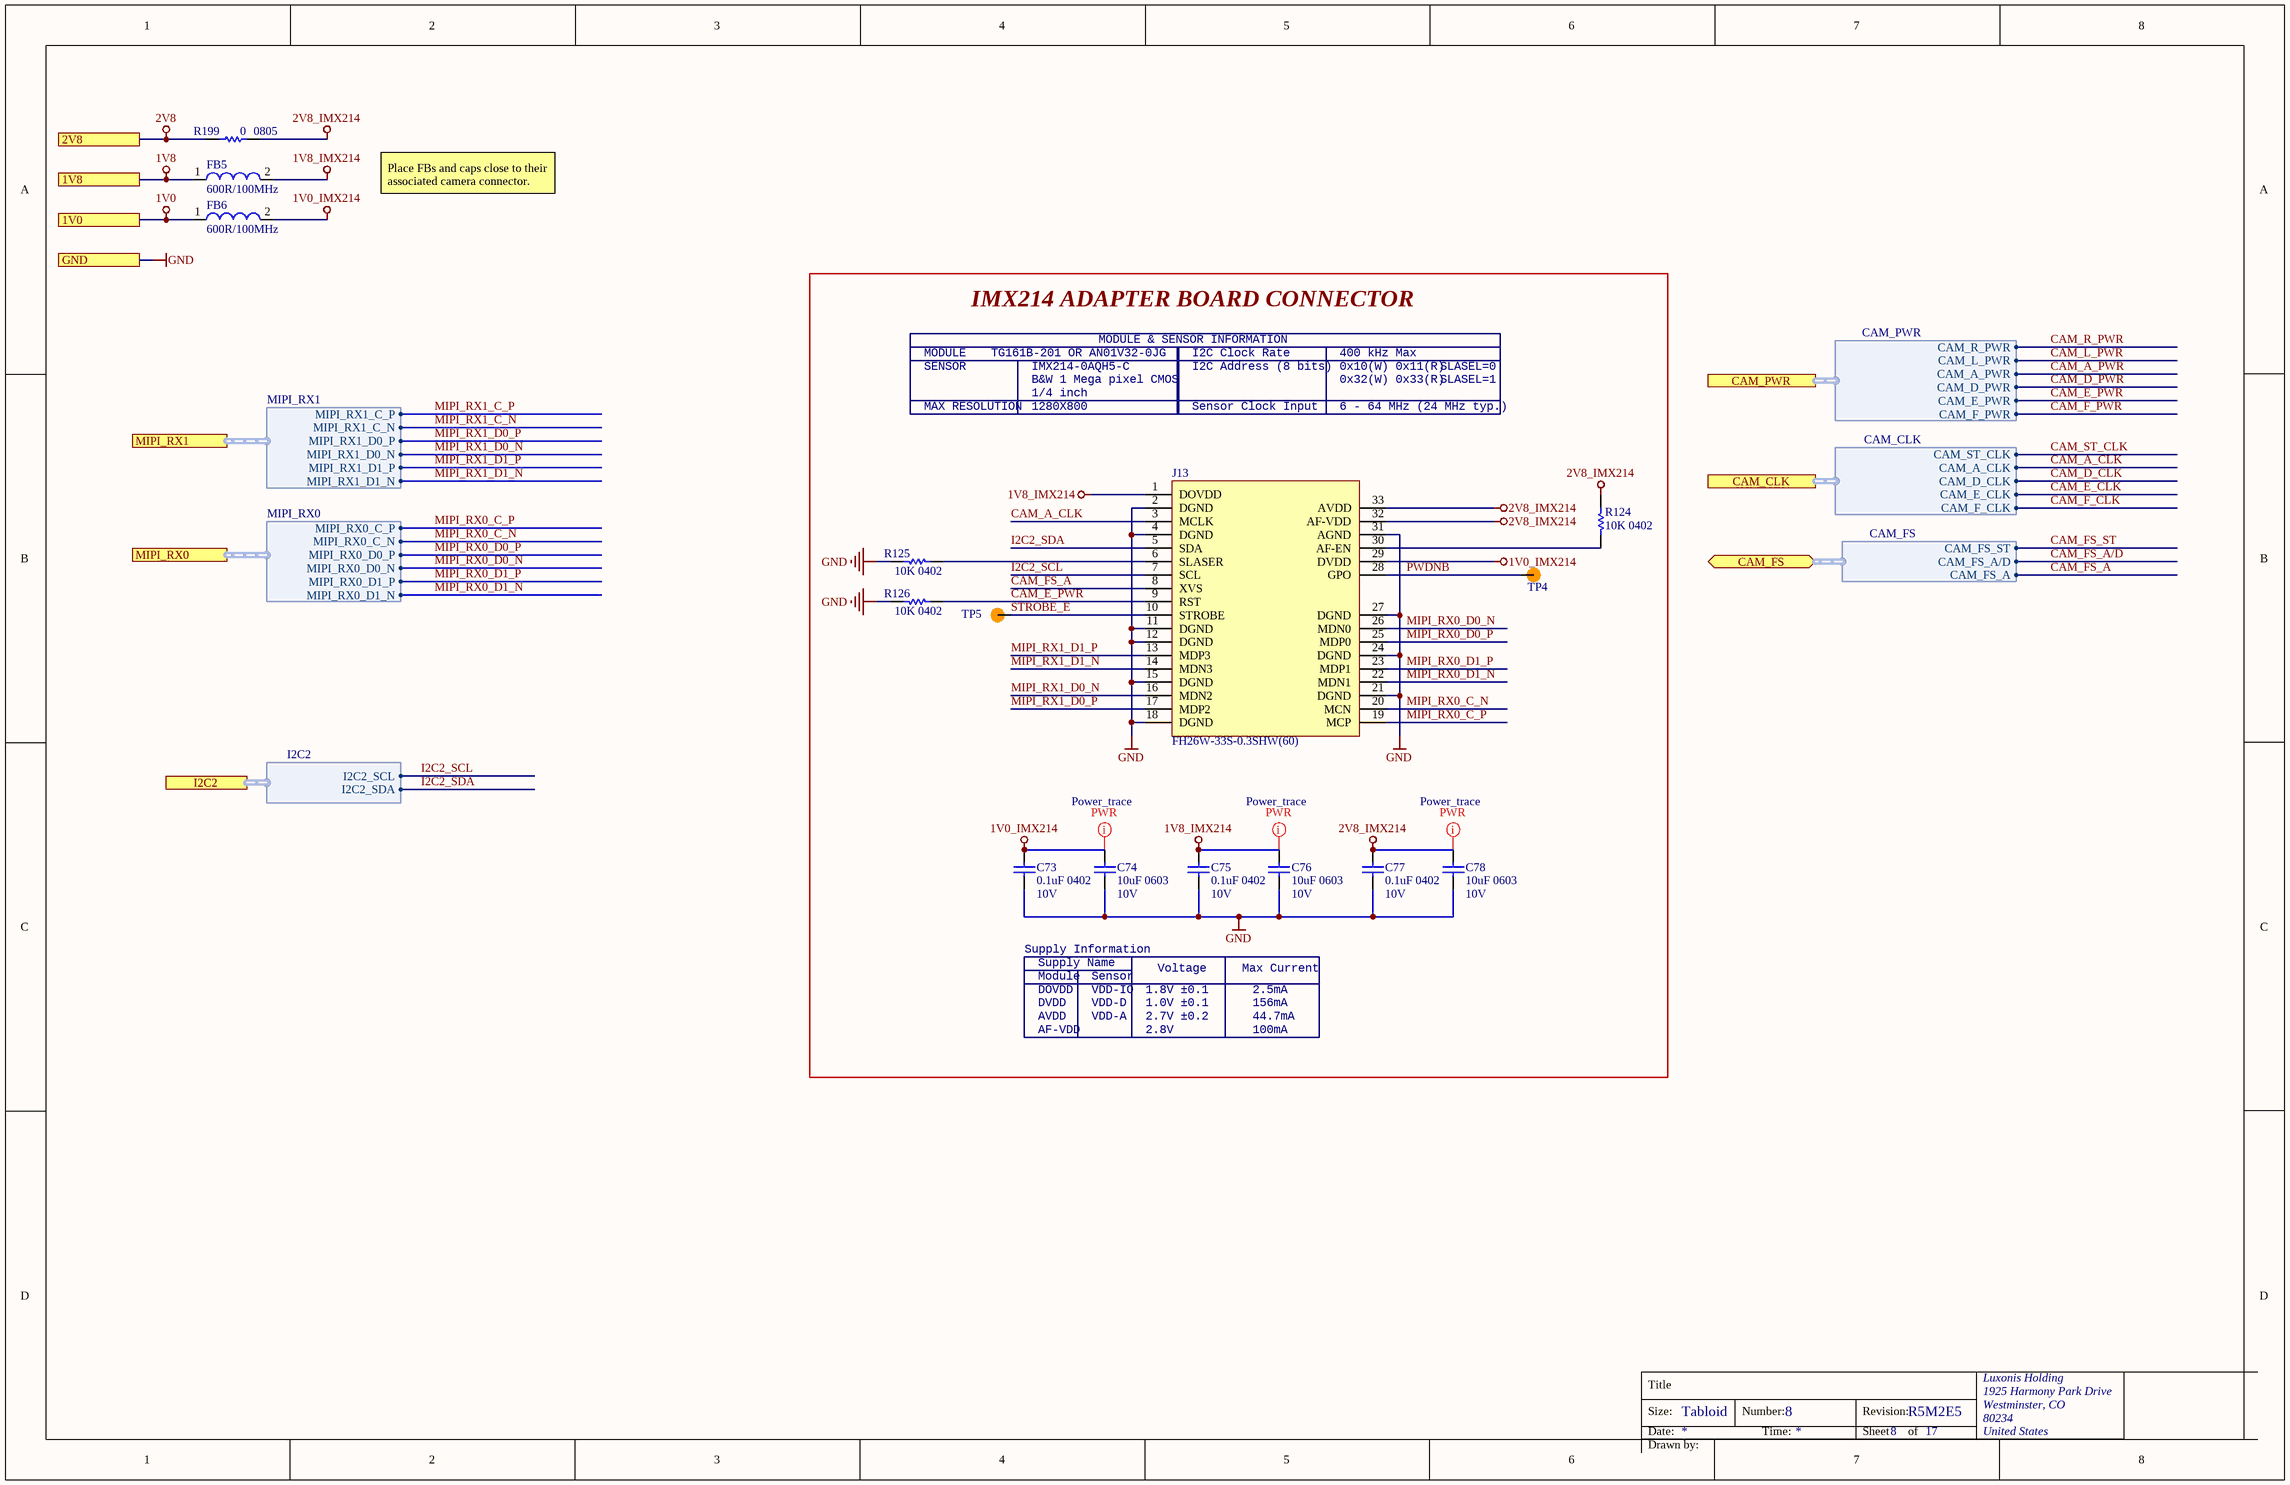
[diagram p12: DM3370_IMX214.SchDoc]

### Parts
C73  0.1uF 0402  Voltage Rating: 10V  [CAPC0402(1005)70_L]
C74  10uF 0603  Voltage Rating: 10V  [CAPC0603(1608)100_L]
C75  0.1uF 0402  Voltage Rating: 10V  [CAPC0402(1005)70_L]
C76  10uF 0603  Voltage Rating: 10V  [CAPC0603(1608)100_L]
C77  0.1uF 0402  Voltage Rating: 10V  [CAPC0402(1005)70_L]
C78  10uF 0603  Voltage Rating: 10V  [CAPC0603(1608)100_L]
FB5  600R/100MHz  [2508056017Y2]
FB6  600R/100MHz  [2508056017Y2]
J13  FH26W-33S-0.3SHW(60)  [FH26W-33S-0.3SHW(60)]
R124  10K 0402  [RESC0402(1005)_L]
R125  10K 0402  [RESC0402(1005)_L]
R126  10K 0402  [RESC0402(1005)_L]
R199  value 0  Case/Package: 0805  [RESC0805(2012)_L]  (hidden comment: CRCW08050000Z0EA)
TP4  TP100_200_NS  [TP100_200_NS]  (value not drawn)  (no BOM)
TP5  TP100_200_NS  [TP100_200_NS]  (value not drawn)  (no BOM)

### Blocks framed on the sheet
IMX214 ADAPTER BOARD CONNECTOR: C73-C78 J13 R124-R126 TP4 TP5

### Ports
1V0, 1V8, 2V8, CAM_CLK (harness CAM_CLK), CAM_FS (bidir, harness CAM_FS), CAM_PWR (harness CAM_PWR), GND, I2C2 (harness I2C2), MIPI_RX0 (harness MIPI_RX0), MIPI_RX1 (harness MIPI_RX1)

### Harnesses
I2C2: I2C2_SDA, I2C2_SCL
CAM_PWR: CAM_R_PWR, CAM_L_PWR, CAM_A_PWR, CAM_D_PWR, CAM_E_PWR, CAM_F_PWR
CAM_CLK: CAM_ST_CLK, CAM_A_CLK, CAM_D_CLK, CAM_E_CLK, CAM_F_CLK
CAM_FS: CAM_FS_ST, CAM_FS_A/D, CAM_FS_A
MIPI_RX0: MIPI_RX0_C_P, MIPI_RX0_C_N, MIPI_RX0_D0_P, MIPI_RX0_D0_N, MIPI_RX0_D1_P, MIPI_RX0_D1_N
MIPI_RX1: MIPI_RX1_C_P, MIPI_RX1_C_N, MIPI_RX1_D0_P, MIPI_RX1_D0_N, MIPI_RX1_D1_P, MIPI_RX1_D1_N

### Nets
1V0: FB6.1 ; port 1V0
1V0_IMX214: C73.2 C74.2 FB6.2 J13.29(DVDD)
1V8: FB5.1 ; port 1V8
1V8_IMX214: C75.2 C76.2 FB5.2 J13.1(DOVDD)
2V8: R199.1 ; port 2V8
2V8_IMX214: C77.2 C78.2 J13.32(AF-VDD) J13.33(AVDD) R124.1 R199.2
GND: C73.1 C74.1 C75.1 C76.1 C77.1 C78.1 J13.2(DGND) J13.4(DGND) J13.11(DGND) J13.12(DGND) J13.15(DGND) J13.18(DGND) J13.21(DGND) J13.24(DGND) J13.27(DGND) J13.31(AGND) R125.2 R126.2 ; port GND
CAM_A_CLK: J13.3(MCLK) ; port CAM_CLK.CAM_A_CLK
CAM_D_CLK: port CAM_CLK.CAM_D_CLK
CAM_E_CLK: port CAM_CLK.CAM_E_CLK
CAM_E_PWR: J13.9(RST) R126.1 ; port CAM_PWR.CAM_E_PWR
CAM_F_CLK: port CAM_CLK.CAM_F_CLK
CAM_F_PWR: port CAM_PWR.CAM_F_PWR
CAM_FS_A: J13.8(XVS) ; port CAM_FS.CAM_FS_A
CAM_FS_A/D: port CAM_FS.CAM_FS_A/D
I2C2_SCL: J13.7(SCL) ; port I2C2.I2C2_SCL
I2C2_SDA: J13.5(SDA) ; port I2C2.I2C2_SDA
MIPI_RX0_C_N: J13.20(MCN) ; port MIPI_RX0.MIPI_RX0_C_N
MIPI_RX0_C_P: J13.19(MCP) ; port MIPI_RX0.MIPI_RX0_C_P
MIPI_RX0_D0_N: J13.26(MDN0) ; port MIPI_RX0.MIPI_RX0_D0_N
MIPI_RX0_D0_P: J13.25(MDP0) ; port MIPI_RX0.MIPI_RX0_D0_P
MIPI_RX0_D1_N: J13.22(MDN1) ; port MIPI_RX0.MIPI_RX0_D1_N
MIPI_RX0_D1_P: J13.23(MDP1) ; port MIPI_RX0.MIPI_RX0_D1_P
MIPI_RX1_D0_N: J13.16(MDN2) ; port MIPI_RX1.MIPI_RX1_D0_N
MIPI_RX1_D0_P: J13.17(MDP2) ; port MIPI_RX1.MIPI_RX1_D0_P
MIPI_RX1_D1_N: J13.14(MDN3) ; port MIPI_RX1.MIPI_RX1_D1_N
MIPI_RX1_D1_P: J13.13(MDP3) ; port MIPI_RX1.MIPI_RX1_D1_P
PWDNB: J13.28(GPO) TP4.1
STROBE_E: J13.10(STROBE) TP5.1
NetJ13_6: J13.6(SLASER) R125.1
NetJ13_30: J13.30(AF-EN) R124.2

### Layout directives
net class Power_trace: 1V0_IMX214, 1V8_IMX214, 2V8_IMX214

### Notes on the sheet
- Place FBs and caps close to their associated camera connector.
- MODULE
- TG161B-201 OR AN01V32-0JG
- MODULE & SENSOR INFORMATION
- I2C Clock Rate
- 400 kHz Max
- SENSOR
- MAX RESOLUTION
- B&W 1 Mega pixel CMOS
- 1280X800
- IMX214-0AQH5-C
- 1/4 inch
- I2C Address (8 bits)
- Sensor Clock Input
- 6 - 64 MHz (24 MHz typ.)
- 0x10(W) 0x11(R)
- 0x32(W) 0x33(R)
- SLASEL=0
- SLASEL=1
- Supply Information
- Supply Name
- Voltage
- Max Current
- AVDD
- DOVDD
- DVDD
- Module
- AF-VDD
- VDD-A
- VDD-IO
- VDD-D
- Sensor
- 2.7V ±0.2
- 1.8V ±0.1
- 1.0V ±0.1
- 2.8V
- 44.7mA
- 2.5mA
- 156mA
- 100mA
- Title
- Size:
- Date:
- Tabloid
- Number:
- Time:
- Revision:
- Sheet
- of
- Drawn by:

### Library data of the parts
C73 C75 C77 = GRM155R71A104JA01D: as C158 on sheet DM3370_LCD_LEDring; Supplier 1: Digi-Key; Manufacturer Part Number 1: GRM155R71A104JA01D; Stock 1: 1346709; Pricing 1: 1=0.10000, 10=0.02500, 100=0.01130, 500=0.00806, 1000=0.00633, 2500=0.00575, 5000=0.00529 (USD); RoHS: Yes; Mount: Surface Mount; Case/Package: 0402; Case Code (Imperial): 0402; Case Code (Metric): 1005; Min Operating Temperature: -55°C; Max Operating Temperature: 125°C; Tolerance: 5%; Packaging: Tape and Reel; Voltage Rating (DC): 10V; Dielectric: X7R; Package Quantity: 10000; Termination: SMD/SMT; Length: 1mm; Height: 0.5mm; Width: 0.02inch; Thickness: 0.022inch; Depth: 0.5mm; Radiation Hardening: No; Lead Free: Lead Free; ComponentLink1URL: https://datasheet.ciiva.com/5411/product-5411135.pdf?src-supplier=Mouser; ComponentLink1Description: https://datasheet.ciiva.com/5411/product-5411135.pdf?src-supplier=Mouser; ComponentLink2URL: https://datasheet.ciiva.com/11618/c02e-11618821.pdf?src-supplier=Avnet; ComponentLink2Description: https://datasheet.ciiva.com/11618/c02e-11618821.pdf?src-supplier=Avnet; Supplier Part Number 1: 490-10777-1-ND
C74 C76 C78 = GRM188R61A106ME69D: as C169 on sheet DM3370_LCD_LEDring; Supplier 1: Digi-Key; Manufacturer Part Number 1: GRM188R61A106ME69D; Stock 1: 2873098; Pricing 1: 1=0.21000, 10=0.14100, 100=0.07130, 500=0.04876, 1000=0.04313 (USD); RoHS: Yes; Mount: Surface Mount; Case/Package: 0603; Weight: 0.000222oz; Case Code (Metric): 1608; Case Code (Imperial): 0603; Min Operating Temperature: -55°C; Max Operating Temperature: 85°C; Packaging: Tape and Reel; Tolerance: 20%; Capacitance: 10uF; Dielectric: X5R; Voltage Rating (DC): 10V; Package Quantity: 4000; Termination: SMD/SMT; Length: 1.6mm; Height: 0.8mm; Width: 0.8mm; Thickness: 0.035inch; Depth: 0.8mm; REACH SVHC: Unknown; Lead Free: Lead Free; ComponentLink1URL: http://www.mouser.com/ds/2/281/c02e-2905.pdf?src-supplier=Mouser; ComponentLink1Description: http://www.mouser.com/ds/2/281/c02e-2905.pdf?src-supplier=Mouser; ComponentLink2URL: http://components.arrow.com/part/dataview/0323_06119472?src-supplier=Arrow+Europe; ComponentLink2Description: http://components.arrow.com/part/dataview/0323_06119472?src-supplier=Arrow+Europe; ComponentLink3URL: http://www.farnell.com/datasheets/2048014.pdf?src-supplier=Farnell; ComponentLink3Description: http://www.farnell.com/datasheets/2048014.pdf?src-supplier=Farnell; ComponentLink4URL: http://www.farnell.com/datasheets/1872210.pdf?src-supplier=Farnell; ComponentLink4Description: http://www.farnell.com/datasheets/1872210.pdf?src-supplier=Farnell; ComponentLink5URL: http://search.murata.co.jp/Ceramy/image/img/A01X/G101/ENG/GRM188R61A106ME69-01.pdf?src-supplier=Digi-Key; ComponentLink5Description: http://search.murata.co.jp/Ceramy/image/img/A01X/G101/ENG/GRM188R61A106ME69-01.pdf?src-supplier=Digi-Key; ComponentLink6URL: http://www.farnell.com/datasheets/1872210.pdf?src-supplier=Newark; ComponentLink6Description: http://www.farnell.com/datasheets/1872210.pdf?src-supplier=Newark; ComponentLink7URL: http://www.farnell.com/datasheets/2048014.pdf?src-supplier=Element14; ComponentLink7Description: http://www.farnell.com/datasheets/2048014.pdf?src-supplier=Element14; ComponentLink8URL: http://www.farnell.com/datasheets/2048014.pdf?src-supplier=Newark; ComponentLink8Description: http://www.farnell.com/datasheets/2048014.pdf?src-supplier=Newark; Supplier Part Number 1: 490-10475-1-ND
FB5 FB6 = 2508056017Y2: as FB7 on sheet DM3370_LCD_LEDring; Supplier 1: Digi-Key; Manufacturer Part Number 1: 2508056017Y2; Stock 1: 100491; Pricing 1: 1=0.10000, 10=0.07900, 25=0.07120, 50=0.05240, 100=0.04520, 250=0.03568, 500=0.03014, 1000=0.02538 (USD); RoHS: Yes; Case/Package: 0805; Number of Pins: 2; Case Code (Metric): 2012; Case Code (Imperial): 0805; Min Operating Temperature: -55°C; Max Operating Temperature: 125°C; Package Quantity: 4000; Packaging: Tape and Reel; Max DC Current: 2A; Termination: SMD/SMT; Military Standard: Not; DC Current: 2A; Current Rating: 2A; Frequency: 100MHz; Length: 2mm; Height: 0.9mm; Width: 1.25mm; Depth: 1.25mm; Radiation Hardening: No; REACH SVHC: No SVHC; ComponentLink1URL: https://datasheet.ciiva.com/3854/3802508056017y2-3854245.pdf?src-supplier=Arrow; ComponentLink1Description: https://datasheet.ciiva.com/3854/3802508056017y2-3854245.pdf?src-supplier=Arrow; ComponentLink2URL: https://datasheet.ciiva.com/22735/652149-22735047.pdf?src-supplier=Element14; ComponentLink2Description: https://datasheet.ciiva.com/22735/652149-22735047.pdf?src-supplier=Element14; ComponentLink3URL: https://datasheet.ciiva.com/1127/26143-1127514.pdf?src-supplier=Farnell; ComponentLink3Description: https://datasheet.ciiva.com/1127/26143-1127514.pdf?src-supplier=Farnell; ComponentLink4URL: https://datasheet.ciiva.com/18090/getdatasheetpartid-212640-18090187.pdf?src-supplier=Verical; ComponentLink4Description: https://datasheet.ciiva.com/18090/getdatasheetpartid-212640-18090187.pdf?src-supplier=Verical; ComponentLink5URL: https://datasheet.ciiva.com/7620/26143-7620140.pdf?src-supplier=Element14; ComponentLink5Description: https://datasheet.ciiva.com/7620/26143-7620140.pdf?src-supplier=Element14; Supplier Part Number 1: 1934-1487-1-ND
J13 = CMP-002-00090-2: as J14 on sheet DM3370_OV9782_1-2; Design Item ID: FH26W-33S-0.3SHW(60); Stock 1: 627; ComponentLink2URL: https://www.hirose.com/product/en/download_file/key_name/FH26/category/Catalog/doc_file_id/49355/?file_category_id=4&item_id=298&is_series=1&src-supplier=Digi-Key; Category: FFC / FPC; ComponentLink3Description: https://www.hirose.com/product/download/?distributor=digikey&amp;type=2d&amp;lang=en&amp;num=FH26W-13S-0.3SHW(60)&src-supplier=Digi-Key; Manufacturer Part Number 1: FH26W-33S-0.3SHW(60); ComponentLink1Description: https://datasheet.ciiva.com:443/pdfs/VipMasterIC/IC/HIRO/HIRO-S-A0007913874/HIRO-S-A0008593114-1.pdf?src-supplier=IHS+Markit; ComponentLink1URL: https://datasheet.ciiva.com:443/pdfs/VipMasterIC/IC/HIRO/HIRO-S-A0007913874/HIRO-S-A0008593114-1.pdf?src-supplier=IHS+Markit; RoHS: Yes; ComponentLink3URL: https://www.hirose.com/product/download/?distributor=digikey&amp;type=2d&amp;lang=en&amp;num=FH26W-13S-0.3SHW(60)&src-supplier=Digi-Key; ComponentLink2Description: https://www.hirose.com/product/en/download_file/key_name/FH26/category/Catalog/doc_file_id/49355/?file_category_id=4&item_id=298&is_series=1&src-supplier=Digi-Key; Pricing 1: 1=1,78000, 10=1,61700, 25=1,51800, 50=1,45200, 100=1,38600, 250=1,25400, 500=1,15500, 1000=0,99000, 2500=0,92400 (USD); Source: LuxonisMaster.SchLib
R124-R126 = RC0402FR-1310KL: as R118 on sheet DM3370_LCD_LEDring; ComponentLink1URL: https://datasheet.ciiva.com/16940/pyu-rc0402-51-rohs-l-6-16940293.pdf?src-supplier=Avnet+Europe; ComponentLink1Description: https://datasheet.ciiva.com/16940/pyu-rc0402-51-rohs-l-6-16940293.pdf?src-supplier=Avnet+Europe; ComponentLink2URL: https://datasheet.ciiva.com/28386/pyu-rc0402-51-rohs-l-6-28386855.pdf?src-supplier=Avnet+Europe; ComponentLink2Description: https://datasheet.ciiva.com/28386/pyu-rc0402-51-rohs-l-6-28386855.pdf?src-supplier=Avnet+Europe; ComponentLink3URL: https://datasheet.ciiva.com/16740/pyu-rc0402-51-rohs-l-6-r-16740602.pdf?src-supplier=Future+Electronics; ComponentLink3Description: https://datasheet.ciiva.com/16740/pyu-rc0402-51-rohs-l-6-r-16740602.pdf?src-supplier=Future+Electronics; ComponentLink4URL: https://datasheet.ciiva.com/8891/pyu-rc0402-51-rohs-l-6-8891339.pdf?src-supplier=Avnet; ComponentLink4Description: https://datasheet.ciiva.com/8891/pyu-rc0402-51-rohs-l-6-8891339.pdf?src-supplier=Avnet; ComponentLink5URL: https://datasheet.ciiva.com/5557/pyu-rc0402-51-rohs-l-6-r-5557997.pdf?src-supplier=Mouser; ComponentLink5Description: https://datasheet.ciiva.com/5557/pyu-rc0402-51-rohs-l-6-r-5557997.pdf?src-supplier=Mouser; ComponentLink6URL: https://datasheet.ciiva.com/7983/1018594-7983533.pdf?src-supplier=Element14; ComponentLink6Description: https://datasheet.ciiva.com/7983/1018594-7983533.pdf?src-supplier=Element14; Supplier 1: Newark; Manufacturer Part Number 1: RC0402FR-1310KL; Stock 1: 62239; Pricing 1: 1=0.10000, 25=0.01200, 100=0.00400, 250=0.00400, 500=0.00300, 1000=0.00300 (USD); RoHS: Yes; Case/Package: 0402; Number of Pins: 2; Contact Plating: Tin,Matte,Lead; Case Code (Imperial): 0402; Case Code (Metric): 1005; Min Operating Temperature: -55°C; Max Operating Temperature: 155°C; Tolerance: 1%; Composition: Thick Film; Packaging: Tape and Reel; Termination: SMD/SMT; Military Standard: Not; Voltage Rating (DC): 50V; Working Voltage: 50V; Number of Terminations: 2; Length: 1mm; Depth: 0.5mm; Radiation Hardening: No; REACH SVHC: No SVHC; Lead Free: Lead Free; Supplier Part Number 1: 67R9960; Supplier 2: Future Electronics; Supplier 3: Mouser; Supplier 4: Element14; Supplier Part Number 2: RC0402FR-1310KL-CUTT; Supplier Part Number 3: 603-RC0402FR-1310KL; Supplier Part Number 4: 1799235
R199 = CMP-013-000034-9: as R19 on sheet DM3370_OV9782_1-2; Design Item ID: CRCW08050000Z0EA; Manufacturer Part Number 1: CRCW08050000Z0EA; Max Operating Temperature: 155°C; Min Operating Temperature: -55°C
TP4 TP5 = TEST_POINT